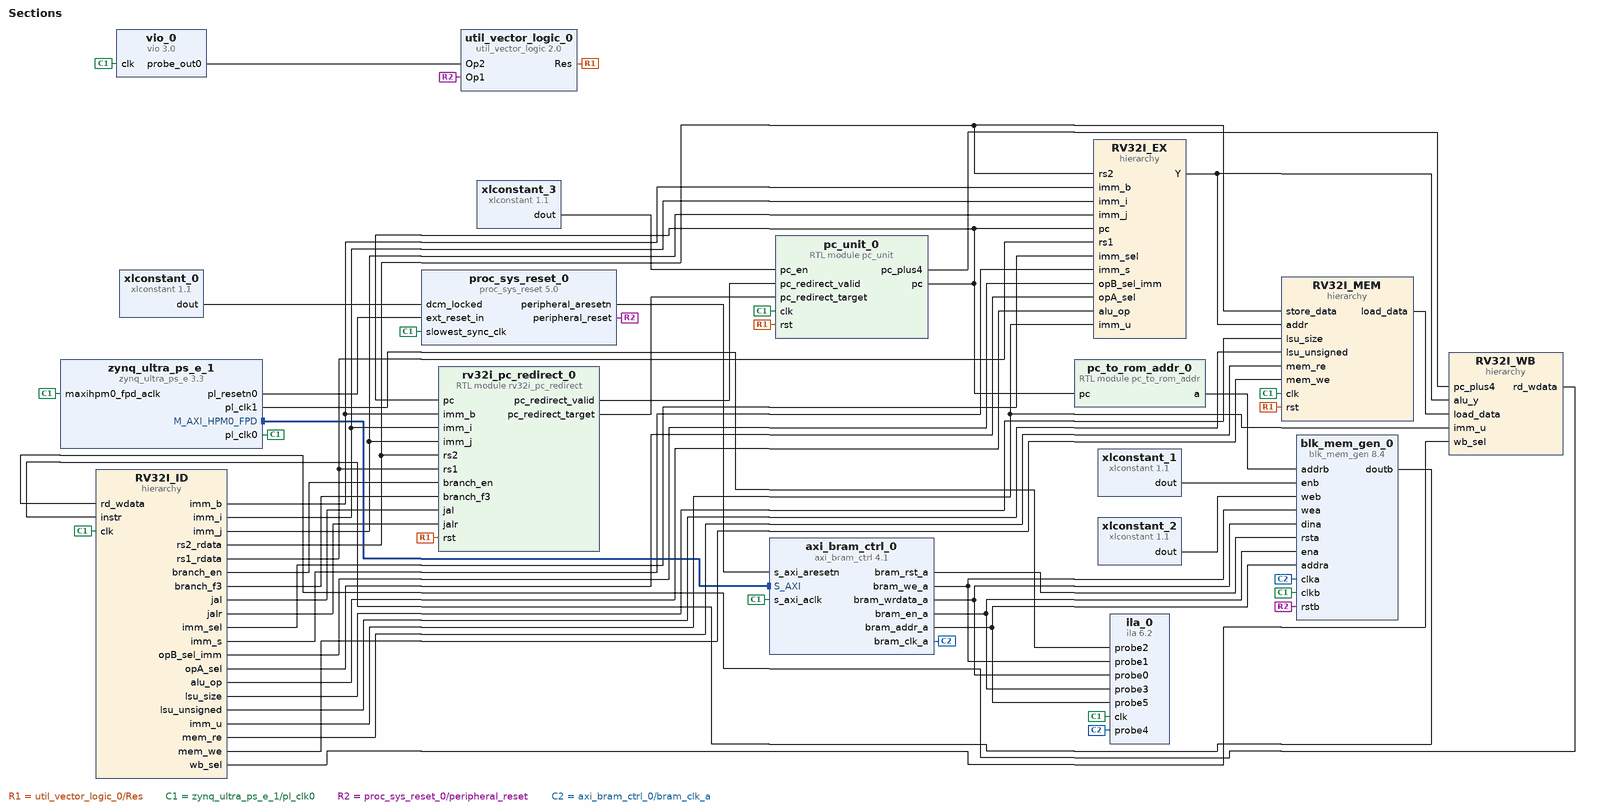
[diagram p0: block diagram of the top level]
# Vivado block design Sections, xczu5ev-sfvc784-2-i, Vivado 2020.1
create_bd_design Sections

create_bd_cell -type ip -vlnv xilinx.com:ip:ila:6.2 ila_0
set_property -dict [list \
  CONFIG.C_ENABLE_ILA_AXI_MON false \
  CONFIG.C_MONITOR_TYPE Native \
  CONFIG.C_NUM_OF_PROBES 6 \
  CONFIG.C_PROBE0_TYPE 0 \
  CONFIG.C_PROBE0_WIDTH 32 \
  CONFIG.C_PROBE10_TYPE 2 \
  CONFIG.C_PROBE1_TYPE 0 \
  CONFIG.C_PROBE1_WIDTH 4 \
  CONFIG.C_PROBE2_TYPE 0 \
  CONFIG.C_PROBE2_WIDTH 1 \
  CONFIG.C_PROBE3_TYPE 0 \
  CONFIG.C_PROBE3_WIDTH 1 \
  CONFIG.C_PROBE4_TYPE 0 \
  CONFIG.C_PROBE4_WIDTH 1 \
  CONFIG.C_PROBE5_TYPE 0 \
  CONFIG.C_PROBE5_WIDTH 32 \
  CONFIG.C_PROBE6_TYPE 0 \
  CONFIG.C_PROBE7_TYPE 0 \
  CONFIG.C_PROBE7_WIDTH 1 \
  CONFIG.C_PROBE8_TYPE 0 \
  CONFIG.C_PROBE9_WIDTH 1 \
] [get_bd_cells ila_0]
create_bd_cell -type ip -vlnv xilinx.com:ip:zynq_ultra_ps_e:3.3 zynq_ultra_ps_e_1
set_property -dict [list \
  CONFIG.CAN0_BOARD_INTERFACE custom \
  CONFIG.CAN1_BOARD_INTERFACE custom \
  CONFIG.CSU_BOARD_INTERFACE custom \
  CONFIG.DP_BOARD_INTERFACE custom \
  CONFIG.GEM0_BOARD_INTERFACE custom \
  CONFIG.GEM1_BOARD_INTERFACE custom \
  CONFIG.GEM2_BOARD_INTERFACE custom \
  CONFIG.GEM3_BOARD_INTERFACE custom \
  CONFIG.GPIO_BOARD_INTERFACE custom \
  CONFIG.IIC0_BOARD_INTERFACE custom \
  CONFIG.IIC1_BOARD_INTERFACE custom \
  CONFIG.NAND_BOARD_INTERFACE custom \
  CONFIG.PCIE_BOARD_INTERFACE custom \
  CONFIG.PJTAG_BOARD_INTERFACE custom \
  CONFIG.PMU_BOARD_INTERFACE custom \
  CONFIG.PSU_BANK_0_IO_STANDARD LVCMOS18 \
  CONFIG.PSU_BANK_1_IO_STANDARD LVCMOS18 \
  CONFIG.PSU_BANK_2_IO_STANDARD LVCMOS18 \
  CONFIG.PSU_BANK_3_IO_STANDARD LVCMOS18 \
  CONFIG.PSU_USB3__DUAL_CLOCK_ENABLE 1 \
  CONFIG.PSU__CAN0__PERIPHERAL__ENABLE 1 \
  CONFIG.PSU__CAN0__PERIPHERAL__IO EMIO \
  CONFIG.PSU__CAN1__PERIPHERAL__ENABLE 0 \
  CONFIG.PSU__CRF_APB__ACPU_CTRL__FREQMHZ 1200 \
  CONFIG.PSU__CRF_APB__ACPU_CTRL__SRCSEL APLL \
  CONFIG.PSU__CRF_APB__APLL_CTRL__SRCSEL PSS_REF_CLK \
  CONFIG.PSU__CRF_APB__DBG_FPD_CTRL__FREQMHZ 250 \
  CONFIG.PSU__CRF_APB__DBG_FPD_CTRL__SRCSEL IOPLL \
  CONFIG.PSU__CRF_APB__DBG_TRACE_CTRL__FREQMHZ 250 \
  CONFIG.PSU__CRF_APB__DBG_TRACE_CTRL__SRCSEL IOPLL \
  CONFIG.PSU__CRF_APB__DBG_TSTMP_CTRL__FREQMHZ 250 \
  CONFIG.PSU__CRF_APB__DBG_TSTMP_CTRL__SRCSEL IOPLL \
  CONFIG.PSU__CRF_APB__DDR_CTRL__FREQMHZ 1200 \
  CONFIG.PSU__CRF_APB__DDR_CTRL__SRCSEL DPLL \
  CONFIG.PSU__CRF_APB__DPDMA_REF_CTRL__FREQMHZ 600 \
  CONFIG.PSU__CRF_APB__DPDMA_REF_CTRL__SRCSEL DPLL \
  CONFIG.PSU__CRF_APB__DPLL_CTRL__SRCSEL PSS_REF_CLK \
  CONFIG.PSU__CRF_APB__DP_AUDIO_REF_CTRL__SRCSEL RPLL \
  CONFIG.PSU__CRF_APB__DP_STC_REF_CTRL__SRCSEL RPLL \
  CONFIG.PSU__CRF_APB__DP_VIDEO_REF_CTRL__SRCSEL VPLL \
  CONFIG.PSU__CRF_APB__GDMA_REF_CTRL__FREQMHZ 600 \
  CONFIG.PSU__CRF_APB__GDMA_REF_CTRL__SRCSEL DPLL \
  CONFIG.PSU__CRF_APB__GPU_REF_CTRL__FREQMHZ 600 \
  CONFIG.PSU__CRF_APB__GPU_REF_CTRL__SRCSEL DPLL \
  CONFIG.PSU__CRF_APB__TOPSW_LSBUS_CTRL__FREQMHZ 100 \
  CONFIG.PSU__CRF_APB__TOPSW_LSBUS_CTRL__SRCSEL IOPLL \
  CONFIG.PSU__CRF_APB__TOPSW_MAIN_CTRL__FREQMHZ 533.333 \
  CONFIG.PSU__CRF_APB__TOPSW_MAIN_CTRL__SRCSEL DPLL \
  CONFIG.PSU__CRF_APB__VPLL_CTRL__SRCSEL PSS_REF_CLK \
  CONFIG.PSU__CRL_APB__ADMA_REF_CTRL__FREQMHZ 500 \
  CONFIG.PSU__CRL_APB__ADMA_REF_CTRL__SRCSEL IOPLL \
  CONFIG.PSU__CRL_APB__CAN1_REF_CTRL__FREQMHZ 100 \
  CONFIG.PSU__CRL_APB__CAN1_REF_CTRL__SRCSEL IOPLL \
  CONFIG.PSU__CRL_APB__CPU_R5_CTRL__FREQMHZ 500 \
  CONFIG.PSU__CRL_APB__CPU_R5_CTRL__SRCSEL IOPLL \
  CONFIG.PSU__CRL_APB__DBG_LPD_CTRL__FREQMHZ 250 \
  CONFIG.PSU__CRL_APB__DBG_LPD_CTRL__SRCSEL IOPLL \
  CONFIG.PSU__CRL_APB__GEM3_REF_CTRL__FREQMHZ 125 \
  CONFIG.PSU__CRL_APB__GEM3_REF_CTRL__SRCSEL IOPLL \
  CONFIG.PSU__CRL_APB__I2C0_REF_CTRL__FREQMHZ 100 \
  CONFIG.PSU__CRL_APB__I2C0_REF_CTRL__SRCSEL IOPLL \
  CONFIG.PSU__CRL_APB__I2C1_REF_CTRL__FREQMHZ 100 \
  CONFIG.PSU__CRL_APB__I2C1_REF_CTRL__SRCSEL IOPLL \
  CONFIG.PSU__CRL_APB__IOPLL_CTRL__SRCSEL PSS_REF_CLK \
  CONFIG.PSU__CRL_APB__IOU_SWITCH_CTRL__FREQMHZ 267 \
  CONFIG.PSU__CRL_APB__IOU_SWITCH_CTRL__SRCSEL RPLL \
  CONFIG.PSU__CRL_APB__LPD_LSBUS_CTRL__FREQMHZ 100 \
  CONFIG.PSU__CRL_APB__LPD_LSBUS_CTRL__SRCSEL IOPLL \
  CONFIG.PSU__CRL_APB__LPD_SWITCH_CTRL__FREQMHZ 500 \
  CONFIG.PSU__CRL_APB__LPD_SWITCH_CTRL__SRCSEL IOPLL \
  CONFIG.PSU__CRL_APB__PCAP_CTRL__FREQMHZ 200 \
  CONFIG.PSU__CRL_APB__PCAP_CTRL__SRCSEL IOPLL \
  CONFIG.PSU__CRL_APB__PL0_REF_CTRL__FREQMHZ 10 \
  CONFIG.PSU__CRL_APB__PL0_REF_CTRL__SRCSEL RPLL \
  CONFIG.PSU__CRL_APB__PL1_REF_CTRL__FREQMHZ 10 \
  CONFIG.PSU__CRL_APB__QSPI_REF_CTRL__FREQMHZ 300 \
  CONFIG.PSU__CRL_APB__QSPI_REF_CTRL__SRCSEL IOPLL \
  CONFIG.PSU__CRL_APB__RPLL_CTRL__SRCSEL PSS_REF_CLK \
  CONFIG.PSU__CRL_APB__SDIO1_REF_CTRL__FREQMHZ 200 \
  CONFIG.PSU__CRL_APB__SDIO1_REF_CTRL__SRCSEL RPLL \
  CONFIG.PSU__CRL_APB__TIMESTAMP_REF_CTRL__FREQMHZ 100 \
  CONFIG.PSU__CRL_APB__TIMESTAMP_REF_CTRL__SRCSEL PSS_REF_CLK \
  CONFIG.PSU__CRL_APB__UART0_REF_CTRL__FREQMHZ 100 \
  CONFIG.PSU__CRL_APB__UART0_REF_CTRL__SRCSEL IOPLL \
  CONFIG.PSU__CRL_APB__UART1_REF_CTRL__FREQMHZ 100 \
  CONFIG.PSU__CRL_APB__UART1_REF_CTRL__SRCSEL IOPLL \
  CONFIG.PSU__CRL_APB__USB0_BUS_REF_CTRL__FREQMHZ 250 \
  CONFIG.PSU__CRL_APB__USB0_BUS_REF_CTRL__SRCSEL IOPLL \
  CONFIG.PSU__CRL_APB__USB3_DUAL_REF_CTRL__FREQMHZ 20 \
  CONFIG.PSU__CRL_APB__USB3_DUAL_REF_CTRL__SRCSEL IOPLL \
  CONFIG.PSU__CRL_APB__USB3__ENABLE 1 \
  CONFIG.PSU__CSUPMU__PERIPHERAL__VALID 0 \
  CONFIG.PSU__DDRC__BUS_WIDTH {64 Bit} \
  CONFIG.PSU__DDRC__COMPONENTS Components \
  CONFIG.PSU__DDRC__DEVICE_CAPACITY {8192 MBits} \
  CONFIG.PSU__DDRC__DRAM_WIDTH {16 Bits} \
  CONFIG.PSU__DDRC__ECC Disabled \
  CONFIG.PSU__DDRC__MEMORY_TYPE {DDR 4} \
  CONFIG.PSU__DDRC__SPEED_BIN DDR4_2400R \
  CONFIG.PSU__DDR_HIGH_ADDRESS_GUI_ENABLE 1 \
  CONFIG.PSU__DDR__INTERFACE__FREQMHZ 600.000 \
  CONFIG.PSU__DEVICE_TYPE EV \
  CONFIG.PSU__DISPLAYPORT__LANE0__ENABLE 1 \
  CONFIG.PSU__DISPLAYPORT__LANE0__IO {GT Lane3} \
  CONFIG.PSU__DISPLAYPORT__LANE1__ENABLE 0 \
  CONFIG.PSU__DISPLAYPORT__PERIPHERAL__ENABLE 1 \
  CONFIG.PSU__DLL__ISUSED 1 \
  CONFIG.PSU__DPAUX__PERIPHERAL__ENABLE 1 \
  CONFIG.PSU__DPAUX__PERIPHERAL__IO {MIO 27 .. 30} \
  CONFIG.PSU__DP__LANE_SEL {Single Higher} \
  CONFIG.PSU__DP__REF_CLK_FREQ 108 \
  CONFIG.PSU__DP__REF_CLK_SEL {Ref Clk3} \
  CONFIG.PSU__ENET3__FIFO__ENABLE 0 \
  CONFIG.PSU__ENET3__GRP_MDIO__ENABLE 1 \
  CONFIG.PSU__ENET3__GRP_MDIO__IO {MIO 76 .. 77} \
  CONFIG.PSU__ENET3__PERIPHERAL__ENABLE 1 \
  CONFIG.PSU__ENET3__PERIPHERAL__IO {MIO 64 .. 75} \
  CONFIG.PSU__ENET3__PTP__ENABLE 0 \
  CONFIG.PSU__ENET3__TSU__ENABLE 0 \
  CONFIG.PSU__FPGA_PL0_ENABLE 1 \
  CONFIG.PSU__FPGA_PL1_ENABLE 1 \
  CONFIG.PSU__GEM3_COHERENCY 0 \
  CONFIG.PSU__GEM3_ROUTE_THROUGH_FPD 0 \
  CONFIG.PSU__GEM__TSU__ENABLE 0 \
  CONFIG.PSU__GPIO0_MIO__IO {MIO 0 .. 25} \
  CONFIG.PSU__GPIO0_MIO__PERIPHERAL__ENABLE 1 \
  CONFIG.PSU__GPIO1_MIO__IO {MIO 26 .. 51} \
  CONFIG.PSU__GPIO1_MIO__PERIPHERAL__ENABLE 1 \
  CONFIG.PSU__GPIO_EMIO_WIDTH 95 \
  CONFIG.PSU__GPIO_EMIO__PERIPHERAL__ENABLE 1 \
  CONFIG.PSU__GPIO_EMIO__PERIPHERAL__IO 95 \
  CONFIG.PSU__GT__LINK_SPEED HBR \
  CONFIG.PSU__GT__PRE_EMPH_LVL_4 0 \
  CONFIG.PSU__GT__VLT_SWNG_LVL_4 0 \
  CONFIG.PSU__I2C0__PERIPHERAL__ENABLE 1 \
  CONFIG.PSU__I2C0__PERIPHERAL__IO EMIO \
  CONFIG.PSU__I2C1__PERIPHERAL__ENABLE 1 \
  CONFIG.PSU__I2C1__PERIPHERAL__IO {MIO 24 .. 25} \
  CONFIG.PSU__IOU_SLCR__IOU_TTC_APB_CLK__TTC0_SEL APB \
  CONFIG.PSU__IOU_SLCR__IOU_TTC_APB_CLK__TTC1_SEL APB \
  CONFIG.PSU__IOU_SLCR__IOU_TTC_APB_CLK__TTC2_SEL APB \
  CONFIG.PSU__IOU_SLCR__IOU_TTC_APB_CLK__TTC3_SEL APB \
  CONFIG.PSU__LPD_SLCR__CSUPMU__FREQMHZ 100 \
  CONFIG.PSU__MAXIGP0__DATA_WIDTH 32 \
  CONFIG.PSU__OVERRIDE_HPX_QOS 0 \
  CONFIG.PSU__OVERRIDE__BASIC_CLOCK 0 \
  CONFIG.PSU__PMU__PERIPHERAL__ENABLE 0 \
  CONFIG.PSU__PRESET_APPLIED 0 \
  CONFIG.PSU__PSS_REF_CLK__FREQMHZ 33.333 \
  CONFIG.PSU__QSPI_COHERENCY 0 \
  CONFIG.PSU__QSPI_ROUTE_THROUGH_FPD 0 \
  CONFIG.PSU__QSPI__GRP_FBCLK__ENABLE 0 \
  CONFIG.PSU__QSPI__PERIPHERAL__DATA_MODE x4 \
  CONFIG.PSU__QSPI__PERIPHERAL__ENABLE 1 \
  CONFIG.PSU__QSPI__PERIPHERAL__IO {MIO 0 .. 12} \
  CONFIG.PSU__QSPI__PERIPHERAL__MODE {Dual Parallel} \
  CONFIG.PSU__SATA__LANE1__IO {GT Lane1} \
  CONFIG.PSU__SATA__PERIPHERAL__ENABLE 1 \
  CONFIG.PSU__SATA__REF_CLK_FREQ 125 \
  CONFIG.PSU__SATA__REF_CLK_SEL {Ref Clk1} \
  CONFIG.PSU__SD0__DATA_TRANSFER_MODE 8Bit \
  CONFIG.PSU__SD0__GRP_POW__ENABLE 1 \
  CONFIG.PSU__SD0__GRP_POW__IO {MIO 23} \
  CONFIG.PSU__SD0__PERIPHERAL__ENABLE 1 \
  CONFIG.PSU__SD0__PERIPHERAL__IO {MIO 13 .. 22} \
  CONFIG.PSU__SD0__RESET__ENABLE 1 \
  CONFIG.PSU__SD0__SLOT_TYPE eMMC \
  CONFIG.PSU__SD1_COHERENCY 0 \
  CONFIG.PSU__SD1_ROUTE_THROUGH_FPD 0 \
  CONFIG.PSU__SD1__DATA_TRANSFER_MODE 4Bit \
  CONFIG.PSU__SD1__GRP_CD__ENABLE 1 \
  CONFIG.PSU__SD1__GRP_CD__IO {MIO 45} \
  CONFIG.PSU__SD1__GRP_POW__ENABLE 0 \
  CONFIG.PSU__SD1__GRP_WP__ENABLE 1 \
  CONFIG.PSU__SD1__GRP_WP__IO {MIO 44} \
  CONFIG.PSU__SD1__PERIPHERAL__ENABLE 1 \
  CONFIG.PSU__SD1__PERIPHERAL__IO {MIO 46 .. 51} \
  CONFIG.PSU__SD1__SLOT_TYPE {SD 2.0} \
  CONFIG.PSU__SWDT0__CLOCK__ENABLE 0 \
  CONFIG.PSU__SWDT0__PERIPHERAL__ENABLE 1 \
  CONFIG.PSU__SWDT0__RESET__ENABLE 0 \
  CONFIG.PSU__SWDT1__CLOCK__ENABLE 0 \
  CONFIG.PSU__SWDT1__PERIPHERAL__ENABLE 1 \
  CONFIG.PSU__SWDT1__RESET__ENABLE 0 \
  CONFIG.PSU__TSU__BUFG_PORT_PAIR 0 \
  CONFIG.PSU__TTC0__CLOCK__ENABLE 0 \
  CONFIG.PSU__TTC0__PERIPHERAL__ENABLE 1 \
  CONFIG.PSU__TTC0__WAVEOUT__ENABLE 0 \
  CONFIG.PSU__TTC1__CLOCK__ENABLE 0 \
  CONFIG.PSU__TTC1__PERIPHERAL__ENABLE 1 \
  CONFIG.PSU__TTC1__WAVEOUT__ENABLE 0 \
  CONFIG.PSU__TTC2__CLOCK__ENABLE 0 \
  CONFIG.PSU__TTC2__PERIPHERAL__ENABLE 1 \
  CONFIG.PSU__TTC2__WAVEOUT__ENABLE 0 \
  CONFIG.PSU__TTC3__CLOCK__ENABLE 0 \
  CONFIG.PSU__TTC3__PERIPHERAL__ENABLE 1 \
  CONFIG.PSU__TTC3__WAVEOUT__ENABLE 0 \
  CONFIG.PSU__UART0__BAUD_RATE 115200 \
  CONFIG.PSU__UART0__MODEM__ENABLE 0 \
  CONFIG.PSU__UART0__PERIPHERAL__ENABLE 1 \
  CONFIG.PSU__UART0__PERIPHERAL__IO {MIO 34 .. 35} \
  CONFIG.PSU__UART1__PERIPHERAL__ENABLE 0 \
  CONFIG.PSU__USB0_COHERENCY 0 \
  CONFIG.PSU__USB0__PERIPHERAL__ENABLE 1 \
  CONFIG.PSU__USB0__PERIPHERAL__IO {MIO 52 .. 63} \
  CONFIG.PSU__USB0__REF_CLK_FREQ 52 \
  CONFIG.PSU__USB0__REF_CLK_SEL {Ref Clk2} \
  CONFIG.PSU__USB2_0__EMIO__ENABLE 0 \
  CONFIG.PSU__USB3_0__EMIO__ENABLE 0 \
  CONFIG.PSU__USB3_0__PERIPHERAL__ENABLE 1 \
  CONFIG.PSU__USB3_0__PERIPHERAL__IO {GT Lane2} \
  CONFIG.PSU__USB__RESET__MODE {Boot Pin} \
  CONFIG.PSU__USB__RESET__POLARITY {Active Low} \
  CONFIG.PSU__USE__IRQ0 0 \
  CONFIG.PSU__USE__M_AXI_GP0 1 \
  CONFIG.PSU__USE__M_AXI_GP1 0 \
  CONFIG.PSU__USE__M_AXI_GP2 0 \
  CONFIG.QSPI_BOARD_INTERFACE custom \
  CONFIG.SATA_BOARD_INTERFACE custom \
  CONFIG.SD0_BOARD_INTERFACE custom \
  CONFIG.SD1_BOARD_INTERFACE custom \
  CONFIG.SPI0_BOARD_INTERFACE custom \
  CONFIG.SPI1_BOARD_INTERFACE custom \
  CONFIG.SUBPRESET1 Custom \
  CONFIG.SUBPRESET2 Custom \
  CONFIG.SWDT0_BOARD_INTERFACE custom \
  CONFIG.SWDT1_BOARD_INTERFACE custom \
  CONFIG.TRACE_BOARD_INTERFACE custom \
  CONFIG.TTC0_BOARD_INTERFACE custom \
  CONFIG.TTC1_BOARD_INTERFACE custom \
  CONFIG.TTC2_BOARD_INTERFACE custom \
  CONFIG.TTC3_BOARD_INTERFACE custom \
  CONFIG.UART0_BOARD_INTERFACE custom \
  CONFIG.UART1_BOARD_INTERFACE custom \
  CONFIG.USB0_BOARD_INTERFACE custom \
  CONFIG.USB1_BOARD_INTERFACE custom \
] [get_bd_cells zynq_ultra_ps_e_1]
# 740 more settings of zynq_ultra_ps_e_1 are not shown: defaults, MIO pin electricals, DDR timing, and values the tool derives
create_bd_cell -type hier RV32I_ID
create_bd_cell -type hier RV32I_EX
create_bd_cell -type hier RV32I_WB
create_bd_cell -type hier RV32I_MEM
create_bd_cell -type ip -vlnv xilinx.com:ip:vio:3.0 vio_0
set_property -dict {CONFIG.C_NUM_PROBE_IN 0} [get_bd_cells vio_0]
create_bd_cell -type ip -vlnv xilinx.com:ip:axi_bram_ctrl:4.1 axi_bram_ctrl_0
set_property -dict {CONFIG.PROTOCOL AXI4 CONFIG.SINGLE_PORT_BRAM 1} [get_bd_cells axi_bram_ctrl_0]
create_bd_cell -type ip -vlnv xilinx.com:ip:xlconstant:1.1 xlconstant_1
create_bd_cell -type ip -vlnv xilinx.com:ip:xlconstant:1.1 xlconstant_2
set_property -dict {CONFIG.CONST_VAL 0 CONFIG.CONST_WIDTH 4} [get_bd_cells xlconstant_2]
create_bd_cell -type module -reference pc_to_rom_addr pc_to_rom_addr_0
set_property -dict {CONFIG.ADDR_W 11} [get_bd_cells pc_to_rom_addr_0]
create_bd_cell -type ip -vlnv xilinx.com:ip:blk_mem_gen:8.4 blk_mem_gen_0
set_property -dict [list \
  CONFIG.Assume_Synchronous_Clk true \
  CONFIG.Enable_B Use_ENB_Pin \
  CONFIG.Memory_Type True_Dual_Port_RAM \
  CONFIG.Port_B_Clock 100 \
  CONFIG.Port_B_Enable_Rate 100 \
  CONFIG.Port_B_Write_Rate 50 \
  CONFIG.Use_RSTB_Pin true \
] [get_bd_cells blk_mem_gen_0]
create_bd_cell -type ip -vlnv xilinx.com:ip:xlconstant:1.1 xlconstant_3
create_bd_cell -type ip -vlnv xilinx.com:ip:util_vector_logic:2.0 util_vector_logic_0
set_property -dict {CONFIG.C_OPERATION or CONFIG.C_SIZE 1} [get_bd_cells util_vector_logic_0]
create_bd_cell -type ip -vlnv xilinx.com:ip:proc_sys_reset:5.0 proc_sys_reset_0
set_property -dict {CONFIG.C_AUX_RESET_HIGH 0} [get_bd_cells proc_sys_reset_0]
create_bd_cell -type ip -vlnv xilinx.com:ip:xlconstant:1.1 xlconstant_0
create_bd_cell -type module -reference pc_unit pc_unit_0
create_bd_cell -type module -reference rv32i_pc_redirect rv32i_pc_redirect_0

# ---- hierarchy /RV32I_ID ----
current_bd_instance /RV32I_ID
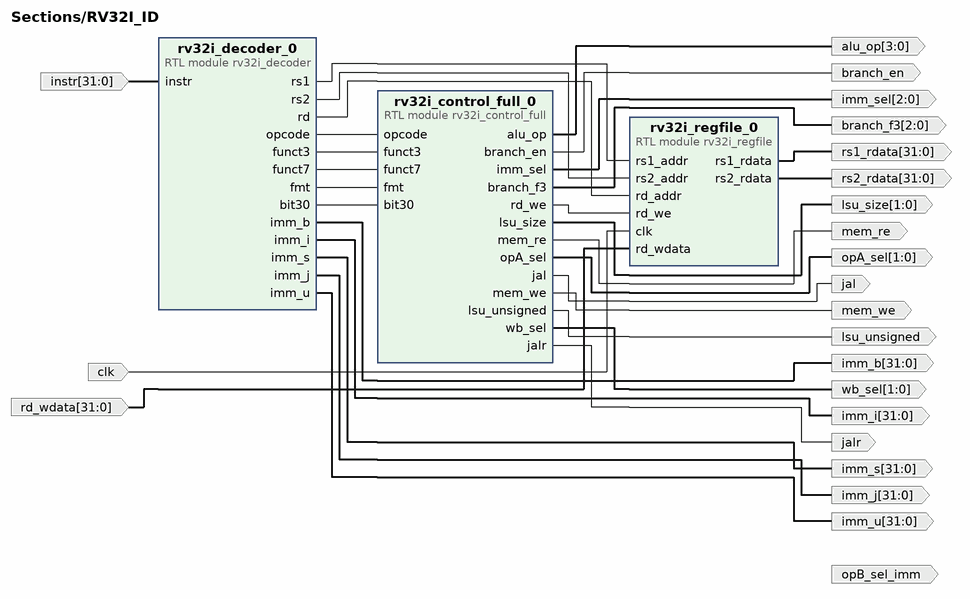
[diagram p1: block diagram inside /RV32I_ID]
create_bd_pin -dir I -type clk clk
create_bd_pin -dir O -from 31 -to 0 rs1_rdata
create_bd_pin -dir O -from 31 -to 0 rs2_rdata
create_bd_pin -dir I -from 31 -to 0 rd_wdata
create_bd_pin -dir O -from 1 -to 0 wb_sel
create_bd_pin -dir O -from 3 -to 0 alu_op
create_bd_pin -dir O -from 1 -to 0 opA_sel
create_bd_pin -dir O opB_sel_imm
create_bd_pin -dir O -from 2 -to 0 imm_sel
create_bd_pin -dir O mem_re
create_bd_pin -dir O mem_we
create_bd_pin -dir O -from 1 -to 0 lsu_size
create_bd_pin -dir O lsu_unsigned
create_bd_pin -dir O branch_en
create_bd_pin -dir O -from 2 -to 0 branch_f3
create_bd_pin -dir O jal
create_bd_pin -dir O jalr
create_bd_pin -dir I -from 31 -to 0 instr
create_bd_pin -dir O -from 31 -to 0 imm_i
create_bd_pin -dir O -from 31 -to 0 imm_s
create_bd_pin -dir O -from 31 -to 0 imm_b
create_bd_pin -dir O -from 31 -to 0 imm_u
create_bd_pin -dir O -from 31 -to 0 imm_j

create_bd_cell -type module -reference rv32i_regfile rv32i_regfile_0
create_bd_cell -type module -reference rv32i_decoder rv32i_decoder_0
create_bd_cell -type module -reference rv32i_control_full rv32i_control_full_0

# ---- hierarchy /RV32I_EX ----
current_bd_instance /RV32I_EX
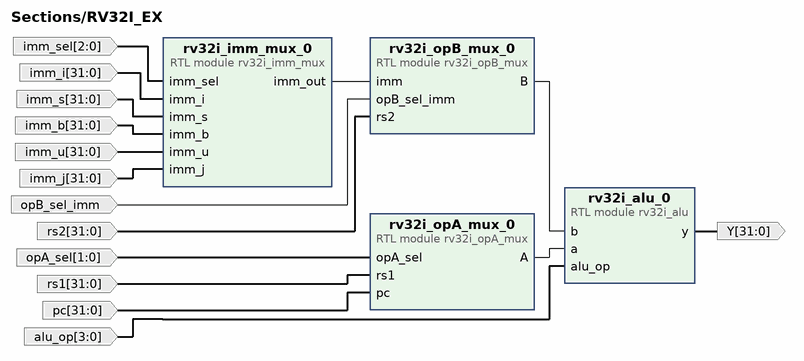
[diagram p2: block diagram inside /RV32I_EX]
create_bd_pin -dir I -from 2 -to 0 imm_sel
create_bd_pin -dir I -from 31 -to 0 imm_i
create_bd_pin -dir I -from 31 -to 0 imm_s
create_bd_pin -dir I -from 31 -to 0 imm_b
create_bd_pin -dir I -from 31 -to 0 imm_u
create_bd_pin -dir I -from 31 -to 0 imm_j
create_bd_pin -dir I opB_sel_imm
create_bd_pin -dir I -from 31 -to 0 rs2
create_bd_pin -dir I -from 1 -to 0 opA_sel
create_bd_pin -dir I -from 31 -to 0 rs1
create_bd_pin -dir I -from 31 -to 0 pc
create_bd_pin -dir I -from 3 -to 0 alu_op
create_bd_pin -dir O -from 31 -to 0 Y

create_bd_cell -type module -reference rv32i_imm_mux rv32i_imm_mux_0
create_bd_cell -type module -reference rv32i_opB_mux rv32i_opB_mux_0
create_bd_cell -type module -reference rv32i_opA_mux rv32i_opA_mux_0
create_bd_cell -type module -reference rv32i_alu rv32i_alu_0

# ---- hierarchy /RV32I_WB ----
current_bd_instance /RV32I_WB
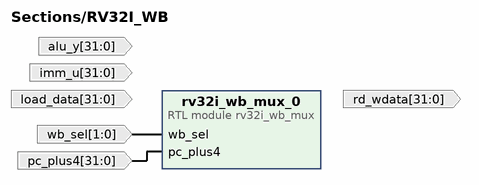
[diagram p3: block diagram inside /RV32I_WB]
create_bd_pin -dir I -from 1 -to 0 wb_sel
create_bd_pin -dir I -from 31 -to 0 alu_y
create_bd_pin -dir I -from 31 -to 0 load_data
create_bd_pin -dir I -from 31 -to 0 pc_plus4
create_bd_pin -dir I -from 31 -to 0 imm_u
create_bd_pin -dir O -from 31 -to 0 rd_wdata

create_bd_cell -type module -reference rv32i_wb_mux rv32i_wb_mux_0

# ---- hierarchy /RV32I_MEM ----
current_bd_instance /RV32I_MEM
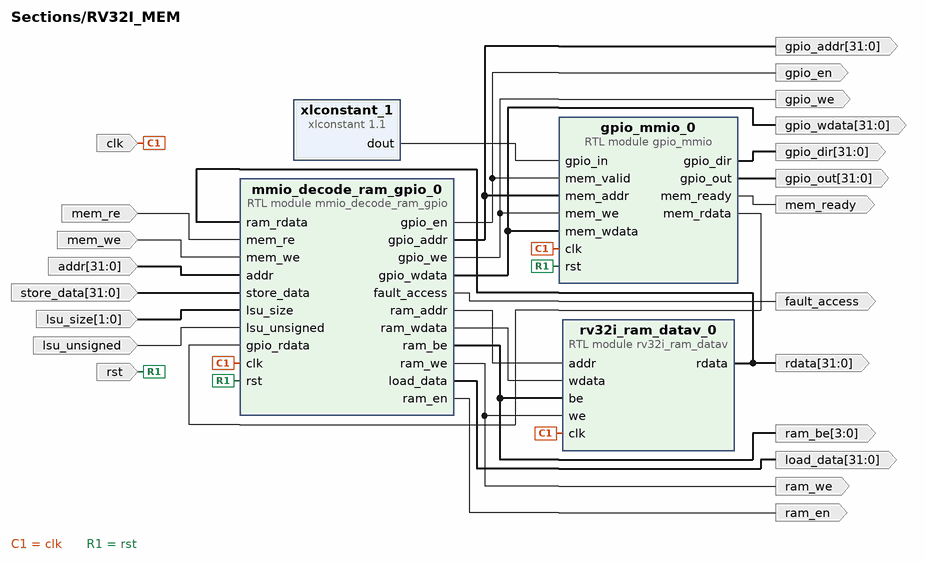
[diagram p4: block diagram inside /RV32I_MEM]
create_bd_pin -dir I -type clk clk
create_bd_pin -dir I -type rst rst
create_bd_pin -dir I mem_re
create_bd_pin -dir I mem_we
create_bd_pin -dir I -from 31 -to 0 addr
create_bd_pin -dir I -from 31 -to 0 store_data
create_bd_pin -dir I -from 1 -to 0 lsu_size
create_bd_pin -dir I lsu_unsigned
create_bd_pin -dir O -from 31 -to 0 load_data
create_bd_pin -dir O -from 31 -to 0 gpio_out
create_bd_pin -dir O -from 31 -to 0 gpio_dir
create_bd_pin -dir O gpio_we
create_bd_pin -dir O gpio_en
create_bd_pin -dir O ram_en
create_bd_pin -dir O ram_we
create_bd_pin -dir O -from 3 -to 0 ram_be
create_bd_pin -dir O mem_ready
create_bd_pin -dir O fault_access
create_bd_pin -dir O -from 31 -to 0 rdata
create_bd_pin -dir O -from 31 -to 0 gpio_addr
create_bd_pin -dir O -from 31 -to 0 gpio_wdata

create_bd_cell -type module -reference mmio_decode_ram_gpio mmio_decode_ram_gpio_0
create_bd_cell -type ip -vlnv xilinx.com:ip:xlconstant:1.1 xlconstant_1
set_property -dict {CONFIG.CONST_VAL 1 CONFIG.CONST_WIDTH 32} [get_bd_cells xlconstant_1]
create_bd_cell -type module -reference gpio_mmio gpio_mmio_0
create_bd_cell -type module -reference rv32i_ram_datav rv32i_ram_datav_0

# ---- connections ----

current_bd_instance /RV32I_ID
connect_bd_net [get_bd_pins rv32i_decoder_0/rs1] [get_bd_pins rv32i_regfile_0/rs1_addr]
connect_bd_net [get_bd_pins rv32i_decoder_0/rs2] [get_bd_pins rv32i_regfile_0/rs2_addr]
connect_bd_net [get_bd_pins rv32i_decoder_0/rd] [get_bd_pins rv32i_regfile_0/rd_addr]
connect_bd_net [get_bd_pins rv32i_control_full_0/rd_we] [get_bd_pins rv32i_regfile_0/rd_we]
connect_bd_net [get_bd_pins rv32i_decoder_0/opcode] [get_bd_pins rv32i_control_full_0/opcode]
connect_bd_net [get_bd_pins rv32i_decoder_0/funct3] [get_bd_pins rv32i_control_full_0/funct3]
connect_bd_net [get_bd_pins rv32i_decoder_0/funct7] [get_bd_pins rv32i_control_full_0/funct7]
connect_bd_net [get_bd_pins rv32i_decoder_0/fmt] [get_bd_pins rv32i_control_full_0/fmt]
connect_bd_net [get_bd_pins rv32i_decoder_0/bit30] [get_bd_pins rv32i_control_full_0/bit30]
connect_bd_net -net zynq_ultra_ps_e_1_pl_clk0 [get_bd_pins clk] [get_bd_pins rv32i_regfile_0/clk]
connect_bd_net [get_bd_pins rv32i_regfile_0/rs1_rdata] [get_bd_pins rs1_rdata]
connect_bd_net [get_bd_pins rv32i_regfile_0/rs2_rdata] [get_bd_pins rs2_rdata]
connect_bd_net -net rv32i_wb_mux_0_rd_wdata [get_bd_pins rd_wdata] [get_bd_pins rv32i_regfile_0/rd_wdata]
connect_bd_net [get_bd_pins rv32i_control_full_0/wb_sel] [get_bd_pins wb_sel]
connect_bd_net [get_bd_pins rv32i_control_full_0/alu_op] [get_bd_pins alu_op]
connect_bd_net [get_bd_pins rv32i_control_full_0/opA_sel] [get_bd_pins opA_sel]
# net rv32i_control_full_0_opB_sel_imm has one end: opB_sel_imm
connect_bd_net [get_bd_pins rv32i_control_full_0/imm_sel] [get_bd_pins imm_sel]
connect_bd_net [get_bd_pins rv32i_control_full_0/mem_re] [get_bd_pins mem_re]
connect_bd_net [get_bd_pins rv32i_control_full_0/mem_we] [get_bd_pins mem_we]
connect_bd_net [get_bd_pins rv32i_control_full_0/lsu_size] [get_bd_pins lsu_size]
connect_bd_net [get_bd_pins rv32i_control_full_0/lsu_unsigned] [get_bd_pins lsu_unsigned]
connect_bd_net [get_bd_pins rv32i_control_full_0/branch_en] [get_bd_pins branch_en]
connect_bd_net [get_bd_pins rv32i_control_full_0/branch_f3] [get_bd_pins branch_f3]
connect_bd_net [get_bd_pins rv32i_control_full_0/jal] [get_bd_pins jal]
connect_bd_net [get_bd_pins rv32i_control_full_0/jalr] [get_bd_pins jalr]
connect_bd_net -net dist_mem_gen_0_spo [get_bd_pins instr] [get_bd_pins rv32i_decoder_0/instr]
connect_bd_net [get_bd_pins rv32i_decoder_0/imm_i] [get_bd_pins imm_i]
connect_bd_net [get_bd_pins rv32i_decoder_0/imm_s] [get_bd_pins imm_s]
connect_bd_net [get_bd_pins rv32i_decoder_0/imm_b] [get_bd_pins imm_b]
connect_bd_net [get_bd_pins rv32i_decoder_0/imm_u] [get_bd_pins imm_u]
connect_bd_net [get_bd_pins rv32i_decoder_0/imm_j] [get_bd_pins imm_j]

current_bd_instance /RV32I_EX
connect_bd_net [get_bd_pins rv32i_imm_mux_0/imm_out] [get_bd_pins rv32i_opB_mux_0/imm]
connect_bd_net [get_bd_pins rv32i_opB_mux_0/B] [get_bd_pins rv32i_alu_0/b]
connect_bd_net [get_bd_pins rv32i_opA_mux_0/A] [get_bd_pins rv32i_alu_0/a]
connect_bd_net -net rv32i_control_full_0_imm_sel [get_bd_pins imm_sel] [get_bd_pins rv32i_imm_mux_0/imm_sel]
connect_bd_net -net rv32i_decoder_0_imm_i [get_bd_pins imm_i] [get_bd_pins rv32i_imm_mux_0/imm_i]
connect_bd_net -net rv32i_decoder_0_imm_s [get_bd_pins imm_s] [get_bd_pins rv32i_imm_mux_0/imm_s]
connect_bd_net -net rv32i_decoder_0_imm_b [get_bd_pins imm_b] [get_bd_pins rv32i_imm_mux_0/imm_b]
connect_bd_net -net rv32i_decoder_0_imm_u [get_bd_pins imm_u] [get_bd_pins rv32i_imm_mux_0/imm_u]
connect_bd_net -net rv32i_decoder_0_imm_j [get_bd_pins imm_j] [get_bd_pins rv32i_imm_mux_0/imm_j]
connect_bd_net -net rv32i_control_full_0_opB_sel_imm [get_bd_pins opB_sel_imm] [get_bd_pins rv32i_opB_mux_0/opB_sel_imm]
connect_bd_net -net rv32i_regfile_0_rs2_rdata [get_bd_pins rs2] [get_bd_pins rv32i_opB_mux_0/rs2]
connect_bd_net -net rv32i_control_full_0_opA_sel [get_bd_pins opA_sel] [get_bd_pins rv32i_opA_mux_0/opA_sel]
connect_bd_net -net rv32i_regfile_0_rs1_rdata [get_bd_pins rs1] [get_bd_pins rv32i_opA_mux_0/rs1]
connect_bd_net -net pc_unit_0_pc [get_bd_pins pc] [get_bd_pins rv32i_opA_mux_0/pc]
connect_bd_net -net rv32i_control_full_0_alu_op [get_bd_pins alu_op] [get_bd_pins rv32i_alu_0/alu_op]
connect_bd_net [get_bd_pins rv32i_alu_0/y] [get_bd_pins Y]

current_bd_instance /RV32I_WB
connect_bd_net -net rv32i_control_full_0_wb_sel [get_bd_pins wb_sel] [get_bd_pins rv32i_wb_mux_0/wb_sel]
# net rv32i_alu_0_Y has one end: alu_y
# net mmio_decode_ram_gpio_0_load_data has one end: load_data
connect_bd_net -net pc_unit_0_pc_plus4 [get_bd_pins pc_plus4] [get_bd_pins rv32i_wb_mux_0/pc_plus4]
# net rv32i_decoder_0_imm_u has one end: imm_u
# net rv32i_wb_mux_0_rd_wdata has one end: rd_wdata

current_bd_instance /RV32I_MEM
connect_bd_net [get_bd_pins mmio_decode_ram_gpio_0/ram_we] [get_bd_pins ram_we] [get_bd_pins rv32i_ram_datav_0/we]
connect_bd_net [get_bd_pins mmio_decode_ram_gpio_0/ram_be] [get_bd_pins ram_be] [get_bd_pins rv32i_ram_datav_0/be]
connect_bd_net [get_bd_pins mmio_decode_ram_gpio_0/ram_addr] [get_bd_pins rv32i_ram_datav_0/addr]
connect_bd_net [get_bd_pins mmio_decode_ram_gpio_0/ram_wdata] [get_bd_pins rv32i_ram_datav_0/wdata]
connect_bd_net [get_bd_pins rv32i_ram_datav_0/rdata] [get_bd_pins mmio_decode_ram_gpio_0/ram_rdata] [get_bd_pins rdata]
connect_bd_net [get_bd_pins mmio_decode_ram_gpio_0/gpio_en] [get_bd_pins gpio_mmio_0/mem_valid] [get_bd_pins gpio_en]
connect_bd_net [get_bd_pins mmio_decode_ram_gpio_0/gpio_we] [get_bd_pins gpio_mmio_0/mem_we] [get_bd_pins gpio_we]
connect_bd_net [get_bd_pins mmio_decode_ram_gpio_0/gpio_addr] [get_bd_pins gpio_mmio_0/mem_addr] [get_bd_pins gpio_addr]
connect_bd_net [get_bd_pins mmio_decode_ram_gpio_0/gpio_wdata] [get_bd_pins gpio_mmio_0/mem_wdata] [get_bd_pins gpio_wdata]
connect_bd_net [get_bd_pins gpio_mmio_0/mem_rdata] [get_bd_pins mmio_decode_ram_gpio_0/gpio_rdata]
connect_bd_net [get_bd_pins xlconstant_1/dout] [get_bd_pins gpio_mmio_0/gpio_in]
connect_bd_net -net zynq_ultra_ps_e_1_pl_clk0 [get_bd_pins clk] \
  [get_bd_pins mmio_decode_ram_gpio_0/clk] [get_bd_pins gpio_mmio_0/clk] [get_bd_pins rv32i_ram_datav_0/clk]
connect_bd_net -net proc_sys_reset_0_peripheral_reset [get_bd_pins rst] [get_bd_pins mmio_decode_ram_gpio_0/rst] [get_bd_pins gpio_mmio_0/rst]
connect_bd_net -net rv32i_control_full_0_mem_re [get_bd_pins mem_re] [get_bd_pins mmio_decode_ram_gpio_0/mem_re]
connect_bd_net -net rv32i_control_full_0_mem_we [get_bd_pins mem_we] [get_bd_pins mmio_decode_ram_gpio_0/mem_we]
connect_bd_net -net rv32i_alu_0_Y [get_bd_pins addr] [get_bd_pins mmio_decode_ram_gpio_0/addr]
connect_bd_net -net rv32i_regfile_0_rs2_rdata [get_bd_pins store_data] [get_bd_pins mmio_decode_ram_gpio_0/store_data]
connect_bd_net -net rv32i_control_full_0_lsu_size [get_bd_pins lsu_size] [get_bd_pins mmio_decode_ram_gpio_0/lsu_size]
connect_bd_net -net rv32i_control_full_0_lsu_unsigned [get_bd_pins lsu_unsigned] [get_bd_pins mmio_decode_ram_gpio_0/lsu_unsigned]
connect_bd_net [get_bd_pins mmio_decode_ram_gpio_0/load_data] [get_bd_pins load_data]
connect_bd_net [get_bd_pins gpio_mmio_0/gpio_out] [get_bd_pins gpio_out]
connect_bd_net [get_bd_pins gpio_mmio_0/gpio_dir] [get_bd_pins gpio_dir]
connect_bd_net [get_bd_pins mmio_decode_ram_gpio_0/ram_en] [get_bd_pins ram_en]
connect_bd_net [get_bd_pins gpio_mmio_0/mem_ready] [get_bd_pins mem_ready]
connect_bd_net [get_bd_pins mmio_decode_ram_gpio_0/fault_access] [get_bd_pins fault_access]

current_bd_instance /
connect_bd_intf_net [get_bd_intf_pins axi_bram_ctrl_0/S_AXI] [get_bd_intf_pins zynq_ultra_ps_e_1/M_AXI_HPM0_FPD]
connect_bd_net -net mmio_decode_ram_gpio_0_load_data [get_bd_pins RV32I_MEM/load_data] [get_bd_pins RV32I_WB/load_data]
connect_bd_net [get_bd_pins pc_unit_0/pc] [get_bd_pins RV32I_EX/pc] [get_bd_pins pc_to_rom_addr_0/pc] [get_bd_pins rv32i_pc_redirect_0/pc]
connect_bd_net [get_bd_pins pc_unit_0/pc_plus4] [get_bd_pins RV32I_WB/pc_plus4]
connect_bd_net -net proc_sys_reset_0_peripheral_reset [get_bd_pins util_vector_logic_0/Res] \
  [get_bd_pins RV32I_MEM/rst] [get_bd_pins pc_unit_0/rst] [get_bd_pins rv32i_pc_redirect_0/rst]
connect_bd_net -net rv32i_alu_0_Y [get_bd_pins RV32I_EX/Y] [get_bd_pins RV32I_WB/alu_y] [get_bd_pins RV32I_MEM/addr]
connect_bd_net -net rv32i_control_full_0_branch_en [get_bd_pins RV32I_ID/branch_en] [get_bd_pins rv32i_pc_redirect_0/branch_en]
connect_bd_net -net rv32i_control_full_0_branch_f3 [get_bd_pins RV32I_ID/branch_f3] [get_bd_pins rv32i_pc_redirect_0/branch_f3]
connect_bd_net -net rv32i_control_full_0_jal [get_bd_pins RV32I_ID/jal] [get_bd_pins rv32i_pc_redirect_0/jal]
connect_bd_net -net rv32i_control_full_0_jalr [get_bd_pins RV32I_ID/jalr] [get_bd_pins rv32i_pc_redirect_0/jalr]
connect_bd_net -net rv32i_control_full_0_lsu_size [get_bd_pins RV32I_ID/lsu_size] [get_bd_pins RV32I_MEM/lsu_size]
connect_bd_net -net rv32i_control_full_0_lsu_unsigned [get_bd_pins RV32I_ID/lsu_unsigned] [get_bd_pins RV32I_MEM/lsu_unsigned]
connect_bd_net -net rv32i_control_full_0_mem_re [get_bd_pins RV32I_ID/mem_re] [get_bd_pins RV32I_MEM/mem_re]
connect_bd_net -net rv32i_control_full_0_mem_we [get_bd_pins RV32I_ID/mem_we] [get_bd_pins RV32I_MEM/mem_we]
connect_bd_net -net rv32i_control_full_0_wb_sel [get_bd_pins RV32I_ID/wb_sel] [get_bd_pins RV32I_WB/wb_sel]
connect_bd_net -net rv32i_decoder_0_imm_b [get_bd_pins RV32I_ID/imm_b] [get_bd_pins RV32I_EX/imm_b] [get_bd_pins rv32i_pc_redirect_0/imm_b]
connect_bd_net -net rv32i_decoder_0_imm_i [get_bd_pins RV32I_ID/imm_i] [get_bd_pins RV32I_EX/imm_i] [get_bd_pins rv32i_pc_redirect_0/imm_i]
connect_bd_net -net rv32i_decoder_0_imm_j [get_bd_pins RV32I_ID/imm_j] [get_bd_pins RV32I_EX/imm_j] [get_bd_pins rv32i_pc_redirect_0/imm_j]
connect_bd_net -net rv32i_decoder_0_imm_u [get_bd_pins RV32I_ID/imm_u] [get_bd_pins RV32I_EX/imm_u] [get_bd_pins RV32I_WB/imm_u]
connect_bd_net -net rv32i_regfile_0_rs1_rdata [get_bd_pins RV32I_ID/rs1_rdata] [get_bd_pins RV32I_EX/rs1] [get_bd_pins rv32i_pc_redirect_0/rs1]
connect_bd_net -net rv32i_regfile_0_rs2_rdata [get_bd_pins RV32I_ID/rs2_rdata] \
  [get_bd_pins RV32I_EX/rs2] [get_bd_pins RV32I_MEM/store_data] [get_bd_pins rv32i_pc_redirect_0/rs2]
connect_bd_net -net rv32i_wb_mux_0_rd_wdata [get_bd_pins RV32I_WB/rd_wdata] [get_bd_pins RV32I_ID/rd_wdata]
connect_bd_net [get_bd_pins zynq_ultra_ps_e_1/pl_clk0] \
  [get_bd_pins ila_0/clk] [get_bd_pins zynq_ultra_ps_e_1/maxihpm0_fpd_aclk] [get_bd_pins RV32I_ID/clk] \
  [get_bd_pins RV32I_MEM/clk] [get_bd_pins vio_0/clk] [get_bd_pins blk_mem_gen_0/clkb] \
  [get_bd_pins axi_bram_ctrl_0/s_axi_aclk] [get_bd_pins proc_sys_reset_0/slowest_sync_clk] [get_bd_pins pc_unit_0/clk]
connect_bd_net [get_bd_pins zynq_ultra_ps_e_1/pl_resetn0] [get_bd_pins proc_sys_reset_0/ext_reset_in]
connect_bd_net -net rv32i_control_full_0_imm_sel [get_bd_pins RV32I_ID/imm_sel] [get_bd_pins RV32I_EX/imm_sel]
connect_bd_net -net rv32i_decoder_0_imm_s [get_bd_pins RV32I_ID/imm_s] [get_bd_pins RV32I_EX/imm_s]
connect_bd_net -net rv32i_control_full_0_opB_sel_imm [get_bd_pins RV32I_ID/opB_sel_imm] [get_bd_pins RV32I_EX/opB_sel_imm]
connect_bd_net -net rv32i_control_full_0_opA_sel [get_bd_pins RV32I_ID/opA_sel] [get_bd_pins RV32I_EX/opA_sel]
connect_bd_net -net rv32i_control_full_0_alu_op [get_bd_pins RV32I_ID/alu_op] [get_bd_pins RV32I_EX/alu_op]
connect_bd_net [get_bd_pins proc_sys_reset_0/peripheral_reset] [get_bd_pins blk_mem_gen_0/rstb] [get_bd_pins util_vector_logic_0/Op1]
connect_bd_net [get_bd_pins vio_0/probe_out0] [get_bd_pins util_vector_logic_0/Op2]
connect_bd_net [get_bd_pins proc_sys_reset_0/peripheral_aresetn] [get_bd_pins axi_bram_ctrl_0/s_axi_aresetn]
connect_bd_net [get_bd_pins blk_mem_gen_0/doutb] [get_bd_pins RV32I_ID/instr]
connect_bd_net [get_bd_pins xlconstant_1/dout] [get_bd_pins blk_mem_gen_0/enb]
connect_bd_net [get_bd_pins xlconstant_2/dout] [get_bd_pins blk_mem_gen_0/web]
connect_bd_net [get_bd_pins pc_to_rom_addr_0/a] [get_bd_pins blk_mem_gen_0/addrb]
connect_bd_net [get_bd_pins rv32i_pc_redirect_0/pc_redirect_valid] [get_bd_pins pc_unit_0/pc_redirect_valid]
connect_bd_net [get_bd_pins rv32i_pc_redirect_0/pc_redirect_target] [get_bd_pins pc_unit_0/pc_redirect_target]
connect_bd_net [get_bd_pins xlconstant_3/dout] [get_bd_pins pc_unit_0/pc_en]
connect_bd_net [get_bd_pins xlconstant_0/dout] [get_bd_pins proc_sys_reset_0/dcm_locked]
connect_bd_net [get_bd_pins axi_bram_ctrl_0/bram_we_a] [get_bd_pins blk_mem_gen_0/wea] [get_bd_pins ila_0/probe1]
connect_bd_net [get_bd_pins zynq_ultra_ps_e_1/pl_clk1] [get_bd_pins ila_0/probe2]
connect_bd_net [get_bd_pins axi_bram_ctrl_0/bram_wrdata_a] [get_bd_pins blk_mem_gen_0/dina] [get_bd_pins ila_0/probe0]
connect_bd_net [get_bd_pins axi_bram_ctrl_0/bram_en_a] [get_bd_pins ila_0/probe3] [get_bd_pins blk_mem_gen_0/ena]
connect_bd_net [get_bd_pins axi_bram_ctrl_0/bram_clk_a] [get_bd_pins blk_mem_gen_0/clka] [get_bd_pins ila_0/probe4]
connect_bd_net [get_bd_pins axi_bram_ctrl_0/bram_addr_a] [get_bd_pins blk_mem_gen_0/addra] [get_bd_pins ila_0/probe5]
connect_bd_net [get_bd_pins axi_bram_ctrl_0/bram_rst_a] [get_bd_pins blk_mem_gen_0/rsta]

# ---- address map ----
assign_bd_address -offset 0x00A0000000 -range 8K -target_address_space [get_bd_addr_spaces zynq_ultra_ps_e_1/Data] [get_bd_addr_segs axi_bram_ctrl_0/S_AXI/Mem0]

validate_bd_design
save_bd_design
